# Altium schematic sheet dribblerconn.SchDoc
size A4
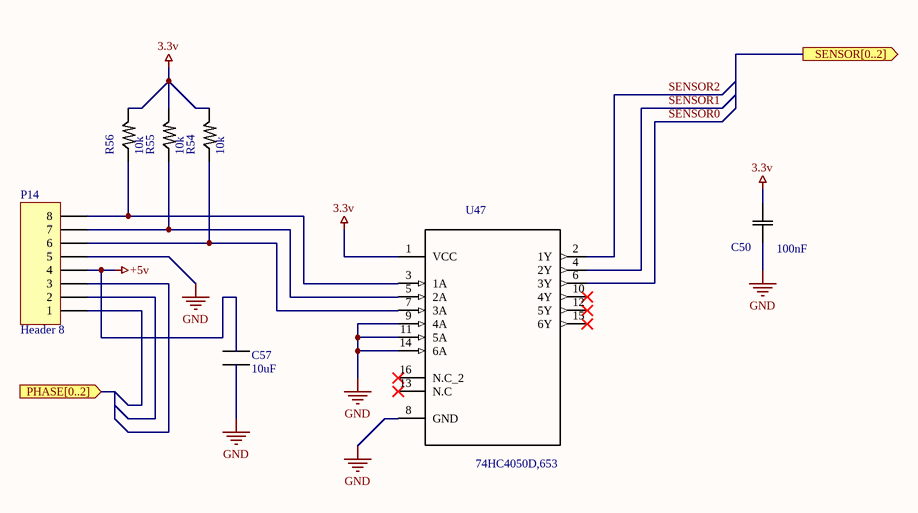
[diagram p0: dribblerconn.SchDoc]

## Parts
C50  100nF  [CAPC2013X110N]
C57  10uF  [CAPC3216X100N]
P14  Header 8  [HDR1X8]
R54  10k  [RESC2012X60]
R55  10k  [RESC2012X60]
R56  10k  [RESC2012X60]
U47  74HC4050D,653  [SOIC127P600X175-16N]

## Ports
PHASE[0..2] (in), SENSOR[0..2] (out)

## Nets
3.3v: C50.2(C2) R54.2 R55.2 R56.2 U47.1(VCC)
+5v: C57.Out P14.4
GND: C50.1(C1) C57.In P14.5 U47.8(GND) U47.9(4A) U47.11(5A) U47.14(6A)
SENSOR0: U47.6(3Y)
SENSOR1: U47.4(2Y)
SENSOR2: U47.2(1Y)
NetP14_6: P14.6 R54.1 U47.7(3A)
NetP14_7: P14.7 R55.1 U47.5(2A)
NetP14_8: P14.8 R56.1 U47.3(1A)

Not connected (* = marked no-connect by the designer): P14 1 2 3; U47 10(4Y)* 12(5Y)* 13(N.C)* 15(6Y)* 16(N.C_2)*

## Library data of the parts
C50 = C0805C104K5RACTU: Capacitor; Ceramic; Cap; .100UF ; Tol+-10%; SMD; Vol-Rtg 50V; X7R, Tape/Reel; MF: Kemet; Package: 0805 Kemet; MP: C0805C104K5RACTU; Value: *
C57 = Component_1
P14 = Header 8: Header, 8-Pin; LatestRevisionDate: 17-Jul-2002; LatestRevisionNote: Re-released for DXP Platform.; Publisher: Altium Limited
R54-R56 = RC0805FR-0710KL: RES SMD 10K OHM 1% 1/8W 0805; MF: Yageo; Package: 0805 Yageo; MP: RC0805FR-0710KL; Value: *
U47 = 74HC4050D,653: 74HC Series 6 V Surface Mount Hex High-to-Low Level Shifter - SOIC-16; MF: Nexperia; Package: SO-16 Nexperia; Digi-Key_Purchase_URL: https://www.digikey.ca/product-detail/en/nexperia-usa-inc/74HC4050D,653/1727-6331-1-ND/2762840?WT.z_cid=ref_snapeda&utm_source=snapeda&utm_medium=aggregator&utm_campaign=buynow; MP: 74HC4050D,653; SnapEDA_Link: https://www.snapeda.com/parts/74HC4050D%2C653/Nexperia/view-part/?ref=snap; Digi-Key_Part_Number: 1727-6331-1-ND; Value: *